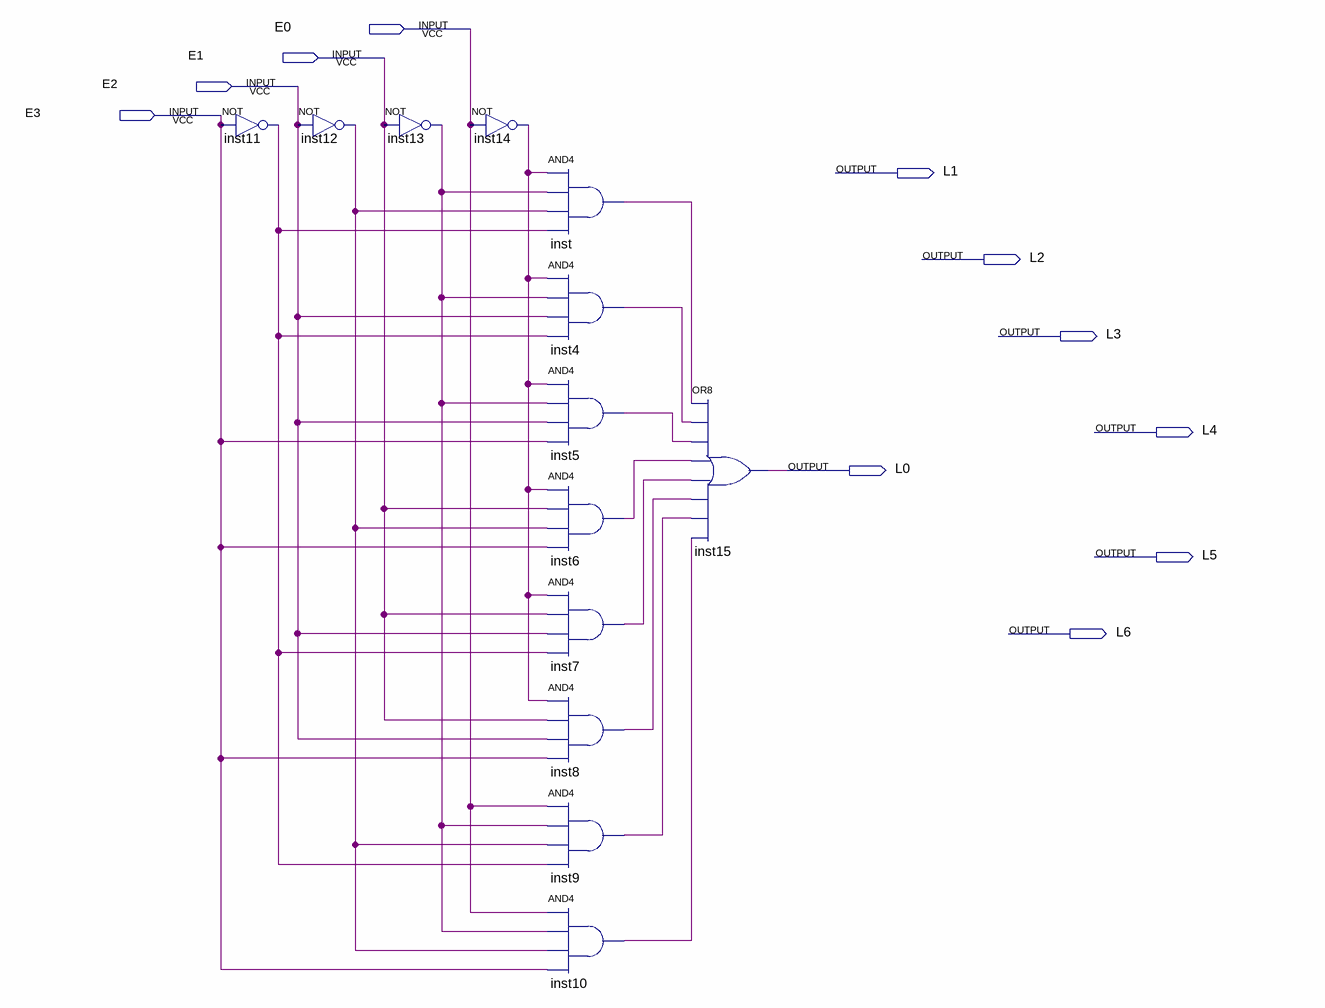
[diagram p0: schematic sheet]
// Quartus schematic decodificador_esq.bdf as structural Verilog: 13 symbols, 11 pins
module decodificador_esq (
  input  E0,
  input  E1,
  input  E2,
  input  E3,
  output L1,
  output L2,
  output L3,
  output L4,
  output L0,
  output L5,
  output L6
);

  wire inst4_out, inst5_out, inst6_out, inst7_out, inst8_out, inst9_out, inst10_out, inst11_out, inst12_out,
       inst13_out, inst14_out, inst_out;

  not inst11 (inst11_out, E3);
  not inst12 (inst12_out, E2);
  not inst13 (inst13_out, E1);
  not inst14 (inst14_out, E0);
  and inst (inst_out, inst14_out, inst13_out, inst12_out, inst11_out);
  and inst4 (inst4_out, inst14_out, inst13_out, E2, inst11_out);
  and inst5 (inst5_out, inst14_out, inst13_out, E2, E3);
  and inst6 (inst6_out, inst14_out, E1, inst12_out, E3);
  and inst7 (inst7_out, inst14_out, E1, E2, inst11_out);
  and inst8 (inst8_out, inst14_out, E1, E2, E3);
  and inst9 (inst9_out, E0, inst13_out, inst12_out, inst11_out);
  and inst10 (inst10_out, E0, inst13_out, inst12_out, E3);
  or inst15 (L0, inst_out, inst4_out, inst5_out, inst6_out, inst7_out, inst8_out, inst9_out, inst10_out);
endmodule
